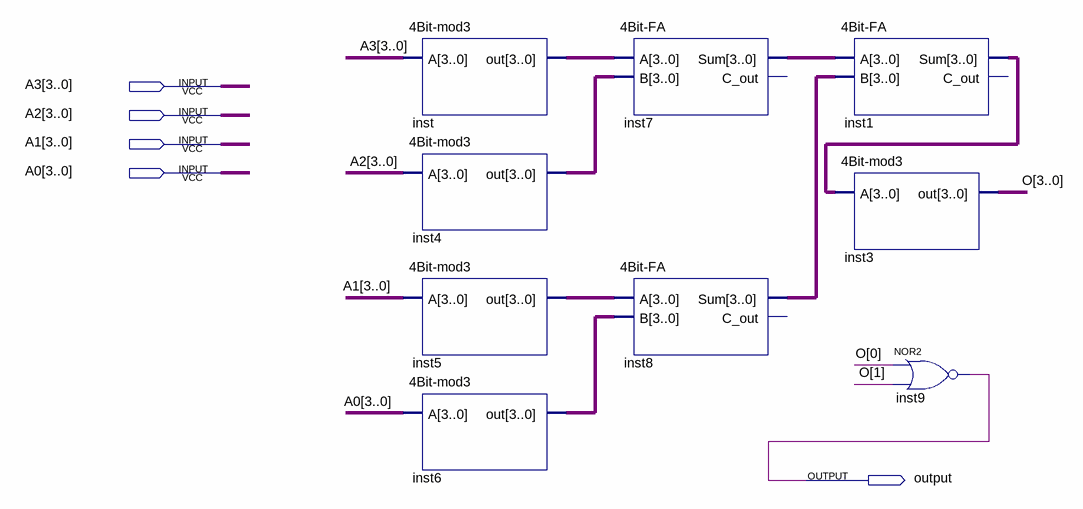
[diagram p0: schematic sheet]
// Quartus schematic Project01-3.bdf as structural Verilog: 9 symbols, 5 pins
module \Project01-3  (
  input  [3:0] A3,
  input  [3:0] A2,
  input  [3:0] A1,
  input  [3:0] A0,
  output \output 
);

  wire [3:0] inst1_sum, inst4_out, inst5_out, inst6_out, inst7_sum, inst8_sum, inst_out, O;

  \4Bit-mod3  inst (.A(A3), .out(inst_out));
  \4Bit-mod3  inst4 (.A(A2), .out(inst4_out));
  \4Bit-mod3  inst5 (.A(A1), .out(inst5_out));
  \4Bit-mod3  inst6 (.A(A0), .out(inst6_out));
  \4Bit-FA  inst7 (.A(inst_out), .B(inst4_out), .Sum(inst7_sum));  // open: C_out
  \4Bit-FA  inst8 (.A(inst5_out), .B(inst6_out), .Sum(inst8_sum));  // open: C_out
  \4Bit-FA  inst1 (.A(inst7_sum), .B(inst8_sum), .Sum(inst1_sum));  // open: C_out
  \4Bit-mod3  inst3 (.A(inst1_sum), .out(O));
  nor inst9 (\output , O[0], O[1]);
endmodule
